# EAGLE design d-ticker (EAGLE 6.6.0)
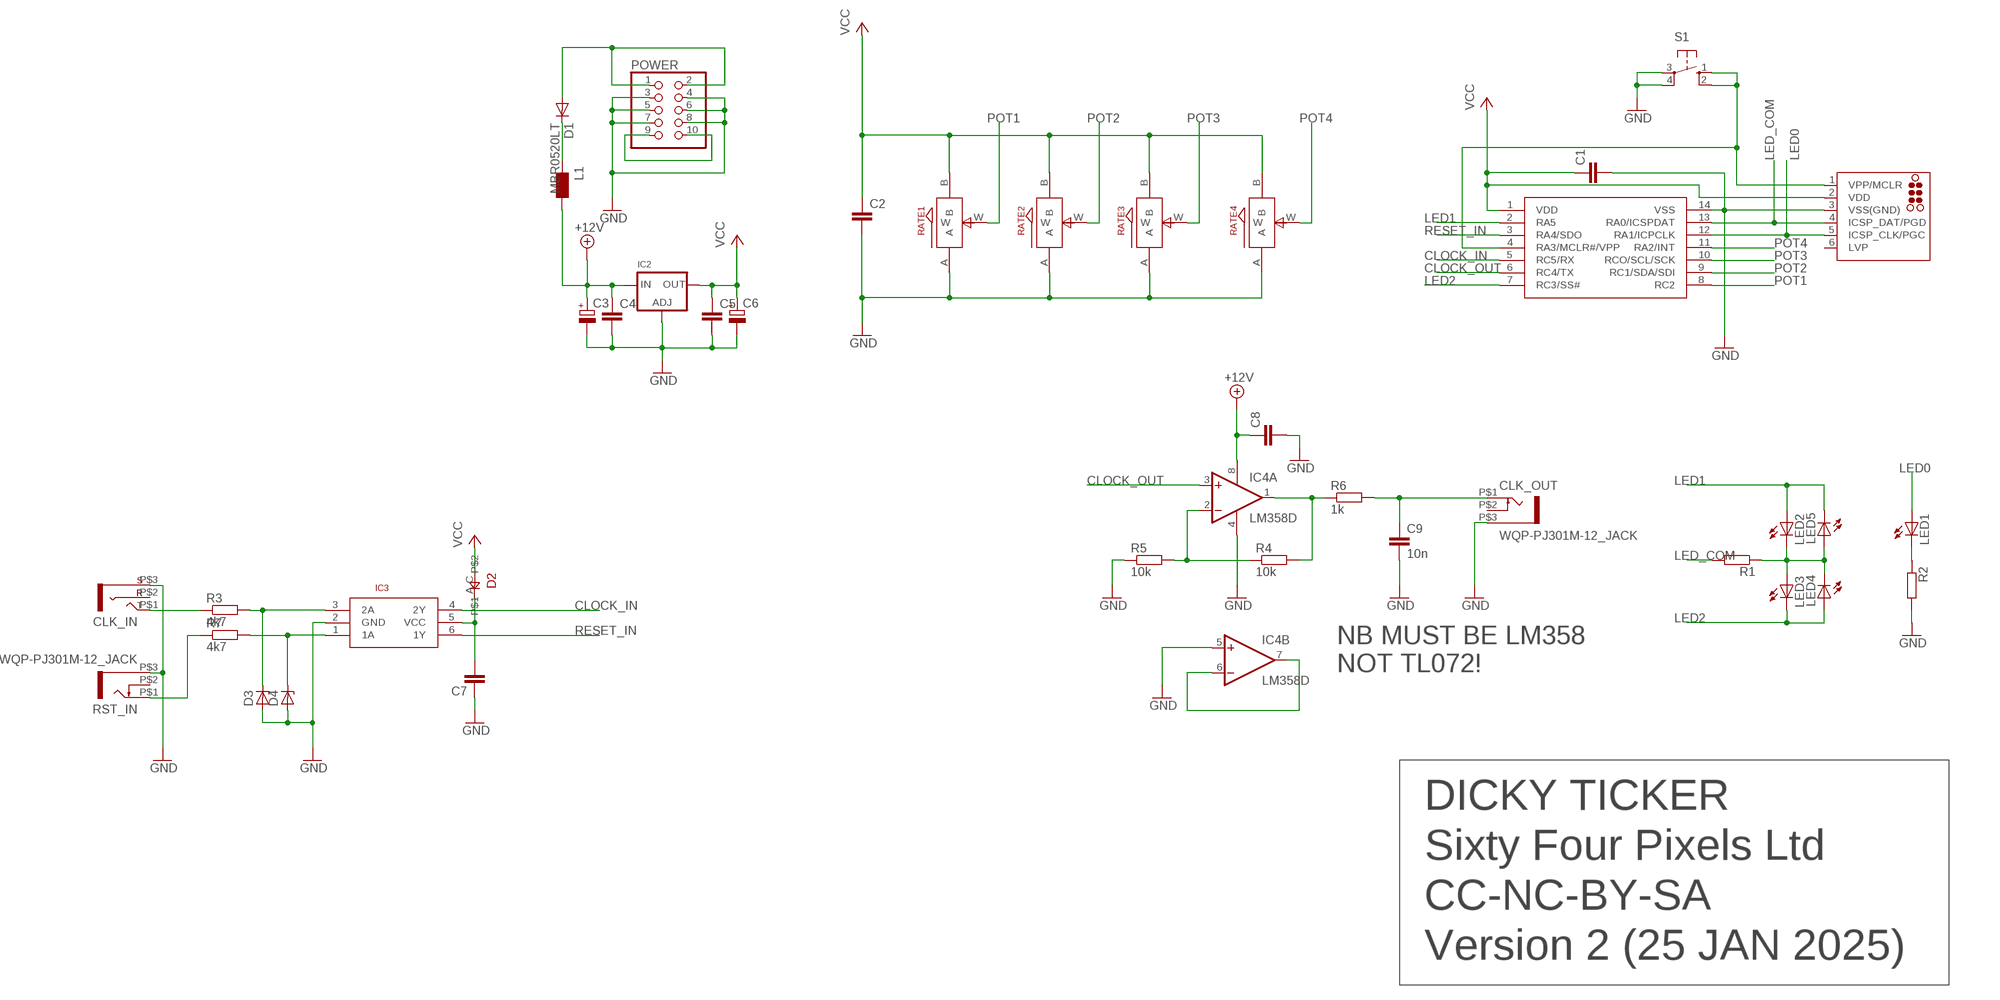
[diagram p0: schematic, sheet 1]

## Parts
C1  C-EUC0805  [C0805]
C2  C-EUC0805  [C0805]
C3  CPOL-EUSMCA  [SMC_A]
C4  C-EUC0805  [C0805]
C5  C-EUC0805  [C0805]
C6  CPOL-EUSMCA  [SMC_A]
C7  C-EUC0805  [C0805]
C8  C-EUC0805  [C0805]
C9  10n  C-EUC0805  [C0805]
CLK_IN  THONKICONN_STEREO  [WQP-PJ301M-ST]
CLK_OUT  WQP-PJ301M-12_JACK  [WQP-PJ301M-12_JACK]
D1  MBR0520LT  [SOD123]
D2  0805DIODE  [0805DIODE]
D3  ZENER-DIODESOD80C  [SOD80C]
D4  ZENER-DIODESOD80C  [SOD80C]
IC1  PIC16F1825SO14  [SO14]
IC2  LM1117SOT223-WAVE  [SOT223-W]
IC3  SN74LVC2G14  [DBV_R-PDSO-G6]
IC4  LM358D  [SO08]
ICSP  TC2030-MCP-NL  [TC2030-MCP-NL]
L1  WE-CBF_0805  [0805]
LED1  LED3MM  [LED3MM]
LED2  LED3MM  [LED3MM]
LED3  LED3MM  [LED3MM]
LED4  LED3MM  [LED3MM]
LED5  LED3MM  [LED3MM]
POWER  PINHD-2X5  [2X05]
R1  R-EU_R0805  [R0805]
R2  R-EU_R0805  [R0805]
R3  4k7  R-EU_R0805  [R0805]
R4  10k  R-EU_R0805  [R0805]
R5  10k  R-EU_R0805  [R0805]
R6  1k  R-EU_R0805  [R0805]
R7  4k7  R-EU_R0805  [R0805]
RATE1  ALPS_POT_SMALL  [SMALL_ALPS_POT]
RATE2  ALPS_POT_SMALL  [SMALL_ALPS_POT]
RATE3  ALPS_POT_SMALL  [SMALL_ALPS_POT]
RATE4  ALPS_POT_SMALL  [SMALL_ALPS_POT]
RST_IN  WQP-PJ301M-12_JACK  [WQP-PJ301M-12_JACK]
S1  10-XX  [B3F-10XX]

## Nets
+12V: C3.+ C4.1 C8.1 IC2.3(IN) IC4.8(P:V+) L1.2
CLOCK_IN: IC1.5(RC5/RX) IC3.4(2Y)
CLOCK_OUT: IC1.6(RC4/TX) IC4.3(A:+IN)
GND: C1.2 C2.2 C3.- C4.2 C5.2 C6.- C7.1 C8.2 C9.2 CLK_IN.P$3(S) CLK_OUT.P$3 D3.A D4.A IC1.14(VSS) IC2.1(ADJ) IC3.2(GND) IC4.4(P:V-) IC4.5(B:+IN) ICSP.3(VSS(GND)) POWER.3 POWER.4 POWER.5 POWER.6 POWER.7 POWER.8 R2.2 R5.1 RATE1.A RATE2.A RATE3.A RATE4.A RST_IN.P$3 S1.3(P) S1.4(P1)
LED0: IC1.12(RA1/ICPCLK) ICSP.5(ICSP_CLK/PGC) LED1.A
LED1: IC1.2(RA5) LED2.A LED5.K(C)
LED2: IC1.7(RC3/SS#) LED3.K(C) LED4.A
LED_COM: IC1.13(RA0/ICSPDAT) ICSP.4(ICSP_DAT/PGD) R1.2
N$1: CLK_IN.P$1(T) R3.1
N$4: C7.2 D2.A IC3.5(VCC)
N$6: IC4.2(A:-IN) R4.1 R5.2
N$7: R7.1 RST_IN.P$1
N$8: IC4.6(B:-IN) IC4.7(B:OUT)
N$9: LED1.K(C) R2.1
N$10: IC4.1(A:OUT) R4.2 R6.1
N$11: C9.1 CLK_OUT.P$1 R6.2
N$12: POWER.9 POWER.10
N$13: D1.A POWER.1 POWER.2
N$14: LED2.K(C) LED3.A LED4.K(C) LED5.A R1.1
N$15: D1.C L1.1
N$16: D3.C IC3.3(2A) R3.2
N$17: D4.C IC3.1(1A) R7.2
N$19: IC1.4(RA3/MCLR#/VPP) ICSP.1(VPP/MCLR) S1.1(S) S1.2(S1)
POT1: IC1.8(RC2) RATE1.W
POT2: IC1.9(RC1/SDA/SDI) RATE2.W
POT3: IC1.10(RCO/SCL/SCK) RATE3.W
POT4: IC1.11(RA2/INT) RATE4.W
RESET_IN: IC1.3(RA4/SDO) IC3.6(1Y)
VCC: C1.1 C2.1 C5.1 C6.+ D2.C IC1.1(VDD) IC2.2(OUT) ICSP.2(VDD) RATE1.B RATE2.B RATE3.B RATE4.B
Unconnected: CLK_IN.P$2(R) CLK_OUT.P$2 ICSP.6(LVP) RST_IN.P$2

## Notes on the sheet
- NB MUST BE LM358 
  NOT TL072!
- DICKY TICKER
- Sixty Four Pixels Ltd
- CC-NC-BY-SA
- Version 2 (25 JAN 2025)

## Library data of the parts
C1 C2 C4 C5 C7-C9 = rcl:C-EU: CAPACITOR, European symbol
C3 C6 = rcl:CPOL-EU: POLARIZED CAPACITOR, European symbol
CLK_IN = jason_eagle6:THONKICONN_STEREO
CLK_OUT RST_IN = thonkiconn:WQP-PJ301M-12_JACK
D1 = diode:MBR0520LT: SCHOTTKY BARRIER RECTIFIER Source: http://onsemi.com .. MBR0520LT1-D.pdf
D2 = jasons_stuff:0805DIODE
D3 D4 = diode:ZENER-DIODE: Z-Diode
IC1 = jasons_stuff:PIC16F1825
IC2 = microbuilder:LM1117: LM1117 Voltage Regulator LM1117 Adjustable Voltage regulator [Digikey: LM1117IMP-ADJDKR-ND] LM1117 3.3V Voltage regulator [AP1117E33GDIDKR-ND] LM1117 5.0V Voltage regulator [AP1117E50GDIDKR-ND] SOT223-REFLOW - SOT223 package for solder paste/reflow ovens SOT223-WAVE - SOT223 package for hand-soldering (larger pads) Note: For the fixed-voltage regulators, simply set the ADJ pin to GND.
IC3 = jason_eagle6:SN74LVC2G14
IC4 = linear:LM358: OP AMP also LM158; LM258; LM2904 Source: http://cache.national.com/ds/LM/LM158.pdf
ICSP = tag-connect:TC2030: TAG-CONNECT ICSP Connector Manufacturer: Tag-Connect <http://www.tag-connect.com> Cable for easy In-Circuit Serial Programming. Designed for Microchip ICD2, suitable for many others. Two variants - one "with legs" (for hands-free fit on PCB) and another "without legs" for quick programming. PAD Description 1 MCLR/Vpp 2 Vdd 3 GND 4 PGD (ISPDAT) 5 PGC (ISPCLK) 6 nc (used for LVP) ©2009 ROFA.cz - modified and updated by Robert Darlington ‹rdarlington@gmail.com›
L1 = wuerth-elektronik:WE-CBF: SMD EMI Suppression Ferrite Beads - excellent anti-EMI properties - low DCR - impedances till 3000 ohms - rated current up to 6 A
LED1-LED5 = led:LED: LED OSRAM: - CHIPLED LG R971, LG N971, LY N971, LG Q971, LY Q971, LO R971, LY R971 LH N974, LH R974 LS Q976, LO Q976, LY Q976 LO Q996 - Hyper CHIPLED LW Q18S LB Q993, LB Q99A, LB R99A - SideLED LS A670, LO A670, LY A670, LG A670, LP A670 LB A673, LV A673, LT A673, LW A673 LH A674 LY A675 LS A676, LA A676, LO A676, LY A676, LW A676 LS A679, LY A679, LG A679 - Hyper Micro SIDELED® LS Y876, LA Y876, LO Y876, LY Y876 LT Y87S - SmartLED LW L88C, LW L88S LB L89C, LB L89S, LG L890 LS L89K, LO L89K, LY L89K LS L896, LA L896, LO L896, LY L896 - TOPLED LS T670, LO T670, LY T670, LG T670, LP T670 LSG T670, LSP T670, LSY T670, LOP T670, LYG T670 LG T671, LOG T671, LSG T671 LB T673, LV T673, LT T673, LW T673 LH T674 LS T676, LA T676, LO T676, LY T676, LB T676, LH T676, LSB T676, LW T676 LB T67C, LV T67C, LT T67C, LS T67K, LO T67K, LY T67K, LW E67C LS E67B, LA E67B, LO E67B, LY E67B, LB E67C, LV E67C, LT E67C LW T67C LS T679, LY T679, LG T679 LS T770, LO T770, LY T770, LG T770, LP T770 LB T773, LV T773, LT T773, LW T773 LH T774 LS E675, LA E675, LY E675, LS T675 LS T776, LA T776, LO T776, LY T776, LB T776 LHGB T686 LT T68C, LB T68C - Hyper Mini TOPLED® LB M676 - Mini TOPLED Santana® LG M470 LS M47K, LO M47K, LY M47K Source: http://www.osram.convergy.de LUXEON: - LUMILED® LXK2-PW12-R00, LXK2-PW12-S00, LXK2-PW14-U00, LXK2-PW14-V00 LXK2-PM12-R00, LXK2-PM12-S00, LXK2-PM14-U00 LXK2-PE12-Q00, LXK2-PE12-R00, LXK2-PE12-S00, LXK2-PE14-T00, LXK2-PE14-U00 LXK2-PB12-K00, LXK2-PB12-L00, LXK2-PB12-M00, LXK2-PB14-N00, LXK2-PB14-P00, LXK2-PB14-Q00 LXK2-PR12-L00, LXK2-PR12-M00, LXK2-PR14-Q00, LXK2-PR14-R00 LXK2-PD12-Q00, LXK2-PD12-R00, LXK2-PD12-S00 LXK2-PH12-R00, LXK2-PH12-S00 LXK2-PL12-P00, LXK2-PL12-Q00, LXK2-PL12-R00 Source: www.luxeon.com KINGBRIGHT: KA-3528ASYC Source: www.kingbright.com
POWER = pinhead:PINHD-2X5: PIN HEADER
R1-R7 = rcl:R-EU_: RESISTOR, European symbol
RATE1-RATE4 = jasons_stuff:ALPS_POT_SMALL
S1 = switch-omron:10-XX: OMRON SWITCH; MPN: B3F-1000; OC_FARNELL: 176432; OC_NEWARK: 36M3542

## Board
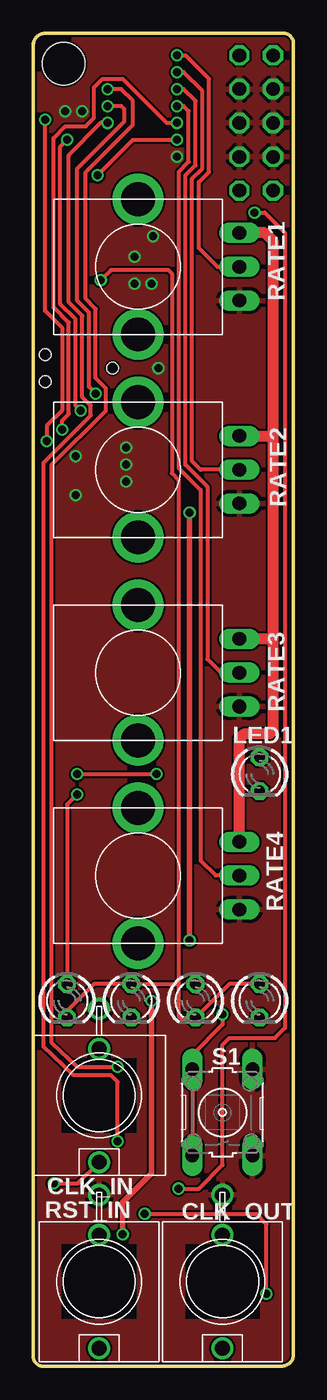
[diagram p1: board, top side]
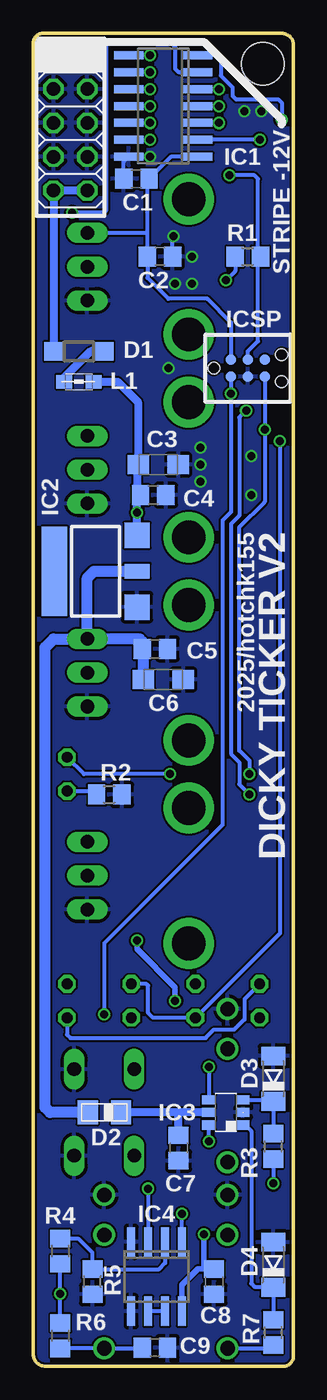
[diagram p2: board, bottom side, seen from below]

Size 19.56 x 100.08 mm. Coordinates in mm from the lower left corner, seen from the top.
Outline: 0,99.19 0,99.31 0,0.76
Outline: 0,99.19 0,0.76
Outline: 0,99.19 arc-90 0.89,100.08 18.8,100.08 arc-90 19.56,99.31 19.56,0.89 arc-90 18.67,0 0.76,0 arc-90 0,0.76
Copper layers (1*16): Top 0.035mm / dielectric 1.5mm / Bottom 0.035mm
Design rules "hackvana": minimum track width 6mil, minimum drill 0.3mm, track to track 6mil, track to pad 9mil, pad to pad 6mil, via to via 6mil, smd to smd 0mil, copper to edge 6mil, drill to drill 6mil, minimum pad ring 10mil, minimum via ring 6mil, stop-mask expansion 2mil, vias tented up to drill 100mil, thermal gap 10mil
Holes 3.2 mm at 2.29,97.79

### Footprints (pad centres in the part's own frame; a part is rotated, then mirrored left to right if it is on the bottom)
C0805 = smd 1.3 x 1.5: 1 -0.95,0; 2 0.95,0
SMC_A = smd 1.6 x 1.4: + -1.5,0; - 1.5,0
WQP-PJ301M-ST = drill 1.1: P$1 0,5; P$2 0,-3.5; P$3 0,-6.5
WQP-PJ301M-12_JACK = drill 1.1: P$1 0,5; P$2 0,-3.5; P$3 0,-6.5
SOD123 = smd 1.4 x 1.4: A 1.9,0; C -1.9,0
0805DIODE = smd 1.524 x 1.778: A -1.262,-0.005; C 1.238,-0.005
SOD80C = smd 1.4 x 1.8: A 1.7,0; C -1.7,0
SO14 = smd 0.6 x 2.2: 1 -3.81,-2.6; 2 -2.54,-2.6; 3 -1.27,-2.6; 4 0,-2.6; 5 1.27,-2.6; 6 2.54,-2.6; 7 3.81,-2.6; 8 3.81,2.6; 9 2.54,2.6; 10 1.27,2.6; 11 0,2.6; 12 -1.27,2.6; 13 -2.54,2.6; 14 -3.81,2.6
SOT223-W = smd 1.9 x 1.9: 1 -2.7,-3.1; 3 2.7,-3.1 | smd 1.1 x 1.9: 2 0,-3.1 | smd 6.7 x 1.9: 4 0,3.1
DBV_R-PDSO-G6 = smd 0.69 x 0.99: 1 -0.95,-1.29; 2 0,-1.29; 3 0.95,-1.29; 4 0.95,1.3; 5 0,1.3; 6 -0.95,1.3
SO08 = smd 0.6 x 2.2: 1 -1.905,-2.6; 2 -0.635,-2.6; 3 0.635,-2.6; 4 1.905,-2.6; 5 1.905,2.6; 6 0.635,2.6; 7 -0.635,2.6; 8 -1.905,2.6
TC2030-MCP-NL = smd 0.787 x 0.787: 1 1.27,-0.635; 2 1.27,0.635; 3 2.54,-0.635; 4 2.54,0.635; 5 3.81,-0.635; 6 3.81,0.635 | hole 0.889: 0,0; 5.08,-1.016; 5.08,1.016
0805 = smd 1.2 x 1: 1 -1.1,0; 2 1.1,0
LED3MM = drill 0.813 octagon: A -1.27,0; K 1.27,0
2X05 = drill 1.016 octagon: 1 -5.08,-1.27; 2 -5.08,1.27; 3 -2.54,-1.27; 4 -2.54,1.27; 5 0,-1.27; 6 0,1.27; 7 2.54,-1.27; 8 2.54,1.27; 9 5.08,-1.27; 10 5.08,1.27
R0805 = smd 1.3 x 1.5: 1 -0.95,0; 2 0.95,0
SMALL_ALPS_POT = drill 1.016 long: A -2.54,-7.62; B 2.54,-7.62; W 0,-7.62 | drill 2.54 pad 3.81: GND@1 -5.08,0; GND@2 5.08,0
B3F-10XX = drill 1.016 long: 1 -3.251,2.261; 2 3.251,2.261; 3 -3.251,-2.261; 4 3.251,-2.261

### Placement (x,y rotation side)
C1  11.81,89.15 180 bottom
C2  10.03,83.31 0 bottom
C3  10.16,67.69 0 bottom
C4  10.54,65.41 0 bottom
C5  10.41,53.85 0 bottom
C6  9.78,51.56 0 bottom
C7  8.64,16.38 90 bottom
C8  5.97,6.35 270 bottom
C9  10.41,1.4 0 bottom
CLK_IN  4.95,20.32 180 top
CLK_OUT  14.22,6.35 180 top
D1  16.13,76.2 180 bottom
D2  14.22,19.05 180 bottom
D3  1.52,21.59 90 bottom
D4  1.52,7.62 90 bottom
IC1  9.78,94.61 90 bottom
IC2  14.86,59.69 90 bottom
IC3  5.08,19.05 90 bottom
IC4  10.29,6.73 180 bottom
ICSP  5.97,74.93 0 bottom
L1  16.13,73.91 0 bottom
LED1  17.02,44.45 270 top
LED2  2.54,27.43 270 top
LED3  7.37,27.43 270 top
LED4  12.19,27.43 270 top
LED5  17.02,27.43 270 top
POWER  16.76,93.34 90 bottom
R1  3.43,83.31 0 bottom
R2  13.84,42.93 0 bottom
R3  1.52,16.51 90 bottom
R4  17.53,8.64 270 bottom
R5  15.11,6.35 90 bottom
R6  17.53,2.29 270 bottom
R7  1.52,2.54 90 bottom
RATE1  7.87,82.55 90 top
RATE2  7.87,67.31 90 top
RATE3  7.87,52.07 90 top
RATE4  7.87,36.83 90 top
RST_IN  4.95,6.35 180 top
S1  14.22,19.05 90 top

### Tracks (layer width: path | path; a pad name or v marks a point on that pad's centre or on a via)
+12V  (via drill 0.6)
  Top 0.406: v6.73,9.91 6.73,12.32 8.89,14.48 v8.89,27.43 | v11.76,64.08 v11.76,31.95
  Bottom 0.406: 11.76,67.59 C3.+ | IC4.8 8.38,6.1 7.18,7.3 6.8,7.3 | C8.1 6.8,7.3 | 6.8,7.3 6.73,7.37 v6.73,9.91 | v8.89,27.43 8.89,28.45 11.76,31.32 v11.76,31.95 | v11.76,64.08 11.68,64.01
  Bottom 0.61: 11.92,62.23 IC2.3 v11.76,64.08 11.76,65.14 C4.1 | 11.76,65.02 C4.1 | 11.76,67.59 11.76,66.11 11.68,66.04 11.68,65.6 C4.1 | L1.2 13.21,73.91 11.68,72.39 11.68,67.72 C3.+
CLOCK_IN  (via drill 0.6)
  Top 0.305: v5.59,95.89 6.6,95.89 7.49,95 7.49,93.22 3.94,89.66 3.94,80.14 4.7,79.38 4.7,74.17 5.46,73.41 5.46,71.75 1.4,67.69 1.4,24.26 3.3,22.48 v6.35,22.48
  Bottom 0.305: v5.59,95.89 IC1.5 | v6.35,22.48 6.35,20.03 IC3.4
CLOCK_OUT  (via drill 0.6)
  Top 0.305: v16.64,86.61 17.4,86.61 18.92,85.09 18.92,25.4 18.16,24.64 14.73,24.64 14.22,24.13 14.22,15.11 12.45,13.34 v10.92,13.34
  Bottom 0.305: v16.64,86.61 14.22,86.61 14.1,86.74 14.1,99.31 13.97,99.44 9.27,99.44 8.89,99.06 8.89,97.41 8.64,97.16 IC1.6 | v10.92,13.34 IC4.3
GND  (via drill 0.6)
  Top 0.305: v9.02,84.84 9.02,84.96 9.14,85.09
  Bottom 0.305: C2.2 9.08,84.77 v9.02,84.84 | C1.2 12.76,90.42 IC1.14
  other vias: 10.8,90.81 3.17,68.33 3.17,65.41 6.99,67.69 6.99,68.96 6.99,66.42 9.4,74.93 7.62,83.31 3.68,94.23 2.41,94.23 7.62,81.28 8.89,81.28
  pour Bottom: 0,100.33 0,0 19.68,0 19.56,99.69
  pour Top: 0,100.46 0,0.13 19.56,0 19.56,100.2
LED0  (via drill 0.6)
  Top 0.305: v2.16,70.31 2.16,70.99 2.67,71.5 2.67,78.36 1.52,79.5 1.52,92.2 2.41,93.09 3.94,93.09 4.57,93.73 4.57,96.01 5.21,96.65 6.73,96.65 10.03,93.34 v10.8,93.34 | v3.3,44.45 v9.27,44.45
  Bottom 0.305: ICSP.5 v2.16,70.31 2.16,64.9 4.06,62.99 4.06,46.23 3.3,45.47 v3.3,44.45 | IC1.12 v10.8,93.34 | v9.27,44.45 15.75,44.45 LED1.A
LED1  (via drill 0.6)
  Top 0.305: v3.56,71.75 3.17,72.14 3.17,78.61 2.03,79.76 2.03,91.57 v2.54,92.08 | v3.3,42.93 2.54,42.16 LED2.A
  Bottom 0.305: v3.56,71.75 4.06,71.25 4.06,63.88 4.7,63.25 4.7,45.97 4.06,45.34 4.06,43.69 v3.3,42.93 | v2.54,92.08 IC1.2 | LED2.A 3.68,27.56 3.68,26.04 4.44,25.27 5.97,25.27 6.6,24.64 16.76,24.64 17.02,24.89 LED5.K
LED2  (via drill 0.6)
  Top 0.305: v1.02,69.47 1.02,70.61 2.16,71.75 2.16,77.98 0.89,79.25 v0.89,93.6
  Bottom 0.305: IC1.7 5.72,98.42 5.46,98.17 5.46,96.9 4.57,96.01 4.57,95.38 4.32,95.12 1.14,95.12 0.89,94.87 v0.89,93.6 | LED4.A 11.05,28.7 10.92,28.57 10.92,26.54 10.54,26.16 LED3.K 1.02,32.51 v1.02,69.47
LED_COM  (via drill 0.6)
  Top 0.305: v4.83,89.41 7.49,92.08 v10.8,92.08
  Bottom 0.305: ICSP.4 3.43,76.2 2.67,76.96 2.67,82.68 | IC1.13 v10.8,92.08 | 2.79,83.82 2.48,83.5 R1.2 2.48,82.86 2.67,82.68 | 2.67,82.68 2.67,89.15 2.92,89.41 v4.83,89.41
N$1  (via drill 0.6)
  Top 0.305: v1.52,13.72 3.35,13.72 CLK_IN.P$1
  Bottom 0.305: R3.1 v1.52,13.72
N$4
  Bottom 0.305: C7.2
  Bottom 0.61: IC3.5 8.64,19.05 | 8.64,19.05 D2.A | C7.2 8.64,19.05
N$6
  Bottom 0.305: R4.1 16.19,9.59 15.11,8.51 R5.2 15.05,7.24 10.16,7.24 9.65,7.75 IC4.2
N$7
  Bottom 0.305: RST_IN.P$1 1.76,1.35 R7.1
N$8
  Bottom 0.305: IC4.7 IC4.6
N$9
  Bottom 0.305: LED1.K 15.05,43.18 R2.1
N$10  (via drill 0.6)
  Top 0.305: v8.38,11.43 16.76,11.43 17.53,10.67 v17.53,5.43
  Bottom 0.305: R6.1 v17.53,5.43 R4.2 | IC4.1 v8.38,11.43
N$11
  Bottom 0.305: C9.1 11.41,1.35 CLK_OUT.P$1 17.51,1.35 R6.2
N$12
  Bottom 0.61: POWER.9 POWER.10
N$13
  Bottom 0.61: POWER.1 POWER.2 D1.A
N$14  (via drill 0.6)
  Top 0.305: LED5.A 14.73,28.7 LED4.K 11.05,26.16 10.92,26.29 10.92,28.57 | LED2.K 2.54,26.67 4.57,28.7 LED3.A 10.8,28.7 10.92,28.57 | 10.92,28.57 10.92,66.55 10.41,67.06 10.41,82.04 10.16,82.3 5.84,82.3 v5.08,81.53
  Bottom 0.305: R1.1 4.38,82.23 v5.08,81.53
N$15
  Bottom 0.61: D1.C 15.24,76.2 17.23,74.21 L1.1
N$16
  Bottom 0.305: R3.2 D3.C 1.63,20 IC3.3
N$17
  Bottom 0.305: R7.2 D4.C 1.57,5.97 2.92,5.97 3.17,6.22 3.17,17.65 3.62,18.1 IC3.1
N$19  (via drill 0.6)
  Top 0.305: v4.7,73.03 4.19,73.53 4.19,79.12 3.3,80.01 3.3,89.92 6.86,93.47 6.86,94.36 6.6,94.61 v5.59,94.61 | v14.22,26.42 14.22,25.65 11.96,23.39 S1.2 S1.1
  Bottom 0.305: ICSP.1 v4.7,73.03 4.7,64.14 5.33,63.5 5.33,40.64 14.22,31.75 v14.22,26.42 | v5.59,94.61 IC1.4
POT1  (via drill 0.6)
  Top 0.305: v10.8,98.42 11.43,98.42 13.21,96.65 13.21,89.66 12.45,88.9 12.45,83.95 13.84,82.55 RATE1.W
  Bottom 0.305: v10.8,98.42 IC1.8
POT2  (via drill 0.6)
  Top 0.305: v10.8,97.16 11.3,97.16 12.7,95.76 12.7,89.92 11.94,89.15 11.94,67.94 12.57,67.31 RATE2.W
  Bottom 0.305: v10.8,97.16 IC1.9
POT3  (via drill 0.6)
  Top 0.305: RATE3.W 14.1,52.07 13.08,53.09 13.08,66.04 11.43,67.69 11.43,89.41 12.19,90.17 12.19,95 11.3,95.89 v10.8,95.89
  Bottom 0.305: v10.8,95.89 IC1.10
POT4  (via drill 0.6)
  Top 0.305: RATE4.W 13.72,36.83 12.57,37.97 12.57,65.79 10.92,67.44 10.92,89.66 11.68,90.42 11.68,94.23 11.3,94.61 v10.8,94.61
  Bottom 0.305: v10.8,94.61 IC1.11
RESET_IN  (via drill 0.6)
  Top 0.305: v5.59,93.34 5.08,93.34 2.67,90.93 2.67,79.88 3.68,78.87 3.68,72.77 4.32,72.14 4.32,71.37 0.76,67.82 0.76,24 3.05,21.84 5.84,21.84 6.35,21.34 v6.35,16.89
  Bottom 0.305: v5.59,93.34 IC1.3 | v6.35,16.89 6.35,18.07 IC3.6
VCC
  Top 0.813: RATE4.B 15.49,47.12 15.88,47.5 17.78,47.5 18.03,47.75 18.03,54.61 | 18.03,54.61 18.03,69.98 | 18.03,69.98 18.03,84.45 17.4,85.09 RATE1.B | RATE2.B 17.91,69.85 18.03,69.98 | 18.03,54.61 RATE3.B
  Bottom 0.305: ICSP.2 4.7,78.36 6.48,80.14 9.4,80.14 10.98,81.72 C2.1 10.98,85.09 | IC1.1 9.21,90.81 C1.1 10.98,89.03 10.98,85.09 | RATE1.B 10.98,85.09
  Bottom 0.813: C6.+ 11.28,53.76 C5.1 11.36,54.42 11.56,54.61 RATE3.B | RATE3.B 15.49,59.18 14.99,59.69 IC2.2 | D2.C 18.29,19.05 18.67,19.43 18.67,53.98 18.03,54.61 RATE3.B

### Text on the board
bPlace: STRIPE -12V | DICKY TICKER V2 | 2025/hotchk155